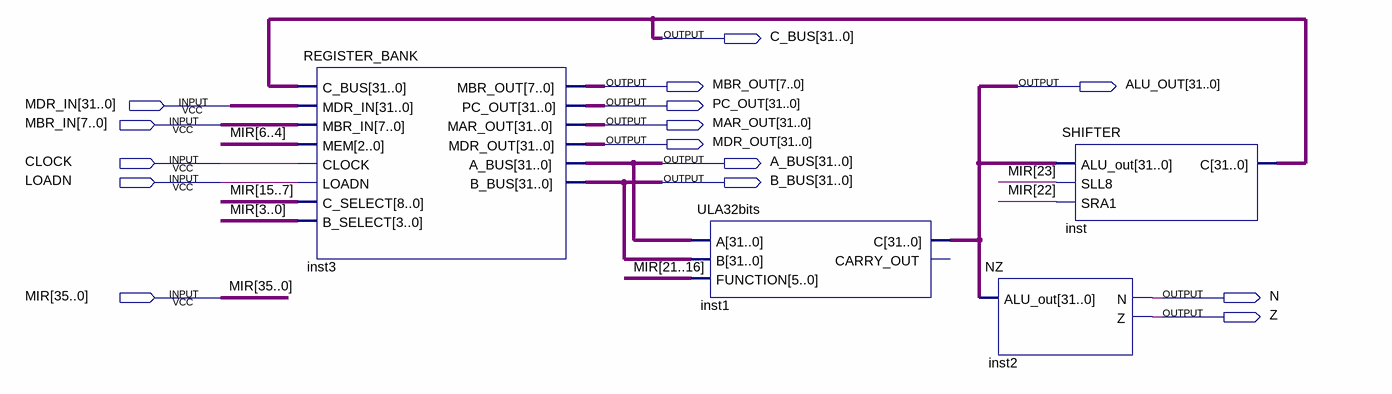
[diagram p0: schematic sheet]
// Quartus schematic DATAPATH.bdf as structural Verilog: 4 symbols, 15 pins
module DATAPATH (
  input  [31:0] MDR_IN,
  input  [7:0] MBR_IN,
  input  CLOCK,
  input  LOADN,
  input  [35:0] MIR,
  output [31:0] C_BUS,
  output [7:0] MBR_OUT,
  output [31:0] ALU_OUT,
  output [31:0] PC_OUT,
  output [31:0] MAR_OUT,
  output [31:0] MDR_OUT,
  output [31:0] A_BUS,
  output [31:0] B_BUS,
  output N,
  output Z
);

  REGISTER_BANK inst3 (
    .C_BUS(C_BUS), .MDR_IN(MDR_IN), .MBR_IN(MBR_IN), .MEM(MIR[6:4]), .CLOCK(CLOCK), .LOADN(LOADN),
    .C_SELECT(MIR[15:7]), .B_SELECT(MIR[3:0]), .MBR_OUT(MBR_OUT), .PC_OUT(PC_OUT), .MAR_OUT(MAR_OUT),
    .MDR_OUT(MDR_OUT), .A_BUS(A_BUS), .B_BUS(B_BUS));
  ULA32bits inst1 (.A(A_BUS), .B(B_BUS), .FUNCTION(MIR[21:16]), .C(ALU_OUT));  // open: CARRY_OUT
  NZ inst2 (.ALU_out(ALU_OUT), .N(N), .Z(Z));
  SHIFTER inst (.ALU_out(ALU_OUT), .SLL8(MIR[23]), .SRA1(MIR[22]), .C(C_BUS));
endmodule
